# Altium schematic sheet TopSheet.SchDoc: UltraZohm IEPE
size A4; Author: Thomas Kreppel; CompanyName: TH Nürnberg; Organization: UltraZohm; Address1: Kesslerplatz 12; Address2: 90489 Nürnberg; Address3: GERMANY; SheetNumber: 1; SheetTotal: 10; CompanyName2: Institut ELSYS
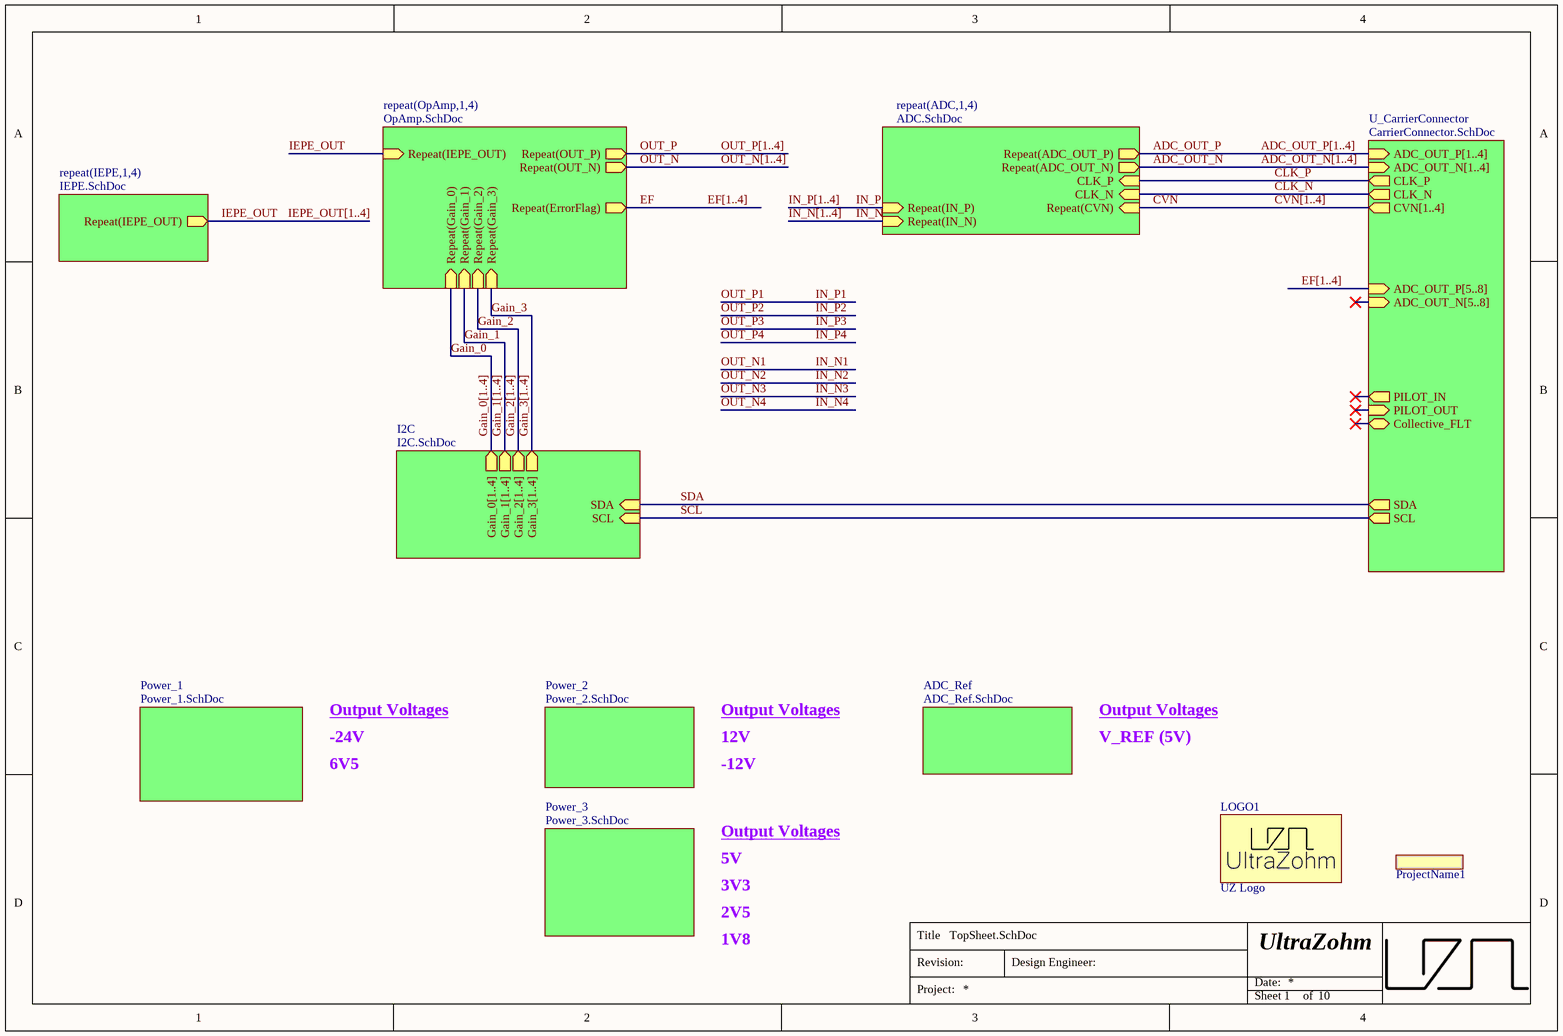
[diagram p0: TopSheet.SchDoc]

## Parts
LOGO1  UZ Logo  [UZ_Logo_tiny]  (no BOM)
ProjectName1  Project Name, Rev  [ID_ProjectRev]  (value not drawn)  (no BOM)

## Sub-sheets
ADC_Ref = ADC_Ref.SchDoc: no entries
I2C = I2C.SchDoc: SDA (in), SCL (in), Gain_1[1..4] (out), Gain_0[1..4] (out), Gain_3[1..4] (out), Gain_2[1..4] (out)
Power_1 = Power_1.SchDoc: no entries
Power_2 = Power_2.SchDoc: no entries
Power_3 = Power_3.SchDoc: no entries
repeat(ADC,1,4) = ADC.SchDoc: CLK_P (in), CLK_N (in), Repeat(ADC_OUT_N) (out), Repeat(ADC_OUT_P) (out), Repeat(CVN) (in), Repeat(IN_P) (in), Repeat(IN_N) (in)
repeat(IEPE,1,4) = IEPE.SchDoc: Repeat(IEPE_OUT) (out)
repeat(OpAmp,1,4) = OpAmp.SchDoc: Repeat(IEPE_OUT) (in), Repeat(OUT_P) (out), Repeat(OUT_N) (out), Repeat(Gain_1) (in), Repeat(Gain_3) (in), Repeat(Gain_0) (in), Repeat(Gain_2) (in), Repeat(ErrorFlag) (out)
U_CarrierConnector = CarrierConnector.SchDoc: PILOT_OUT (in), PILOT_IN (out), Collective_FLT (bidir), CLK_P (out), CLK_N (out), ADC_OUT_P[5..8] (in), ADC_OUT_N[5..8] (in), ADC_OUT_P[1..4] (in), ADC_OUT_N[1..4] (in), CVN[1..4] (out), SDA (out), SCL (out)

## Nets
ADC_OUT_N: sheet repeat(ADC,1,4)/Repeat(ADC_OUT_N)
ADC_OUT_P: sheet repeat(ADC,1,4)/Repeat(ADC_OUT_P)
CLK_N: sheet U_CarrierConnector/CLK_N, sheet repeat(ADC,1,4)/CLK_N
CLK_P: sheet U_CarrierConnector/CLK_P, sheet repeat(ADC,1,4)/CLK_P
CVN: sheet repeat(ADC,1,4)/Repeat(CVN)
EF: sheet repeat(OpAmp,1,4)/Repeat(ErrorFlag)
Gain_0: sheet repeat(OpAmp,1,4)/Repeat(Gain_0)
Gain_1: sheet repeat(OpAmp,1,4)/Repeat(Gain_1)
Gain_2: sheet repeat(OpAmp,1,4)/Repeat(Gain_2)
Gain_3: sheet repeat(OpAmp,1,4)/Repeat(Gain_3)
IEPE_OUT: sheet repeat(OpAmp,1,4)/Repeat(IEPE_OUT), sheet repeat(IEPE,1,4)/Repeat(IEPE_OUT)
IN_N: sheet repeat(ADC,1,4)/Repeat(IN_N)
IN_P: sheet repeat(ADC,1,4)/Repeat(IN_P)
OUT_N: sheet repeat(OpAmp,1,4)/Repeat(OUT_N)
OUT_P: sheet repeat(OpAmp,1,4)/Repeat(OUT_P)
SCL: sheet U_CarrierConnector/SCL, sheet I2C/SCL
SDA: sheet U_CarrierConnector/SDA, sheet I2C/SDA

## Buses and harness runs
bus ADC_OUT_N[1..4] = sheet U_CarrierConnector/ADC_OUT_N[1..4]
bus ADC_OUT_P[1..4] = sheet U_CarrierConnector/ADC_OUT_P[1..4]
bus CVN[1..4] = sheet U_CarrierConnector/CVN[1..4]
bus EF[1..4]
bus EF[1..4] = sheet U_CarrierConnector/ADC_OUT_P[5..8]
bus Gain_0[1..4] = sheet I2C/Gain_0[1..4]
bus Gain_1[1..4] = sheet I2C/Gain_1[1..4]
bus Gain_2[1..4] = sheet I2C/Gain_2[1..4]
bus Gain_3[1..4] = sheet I2C/Gain_3[1..4]
bus IEPE_OUT[1..4]
bus IN_N[1..4]
bus IN_P[1..4]
bus OUT_N[1..4]
bus OUT_P[1..4]

## Notes on the sheet
- Output Voltages
- 6V5
- -24V
- 12V
- -12V
- V_REF (5V)
- 5V
- 2V5
- 3V3
- 1V8
- Title
- Revision:
- Design Engineer:
- Date:
- Project:
- Sheet
- of

## Library data of the parts
LOGO1 = UZ Logo: UltraZohm Logo on PCB; Created: Jan2021_Liegmann; Value: UZ Logo
ProjectName1 = ID_ProjectRev: Project Name and Revision Number; Created: 2018_11_23_AGeiger; Value: Project Name, Rev